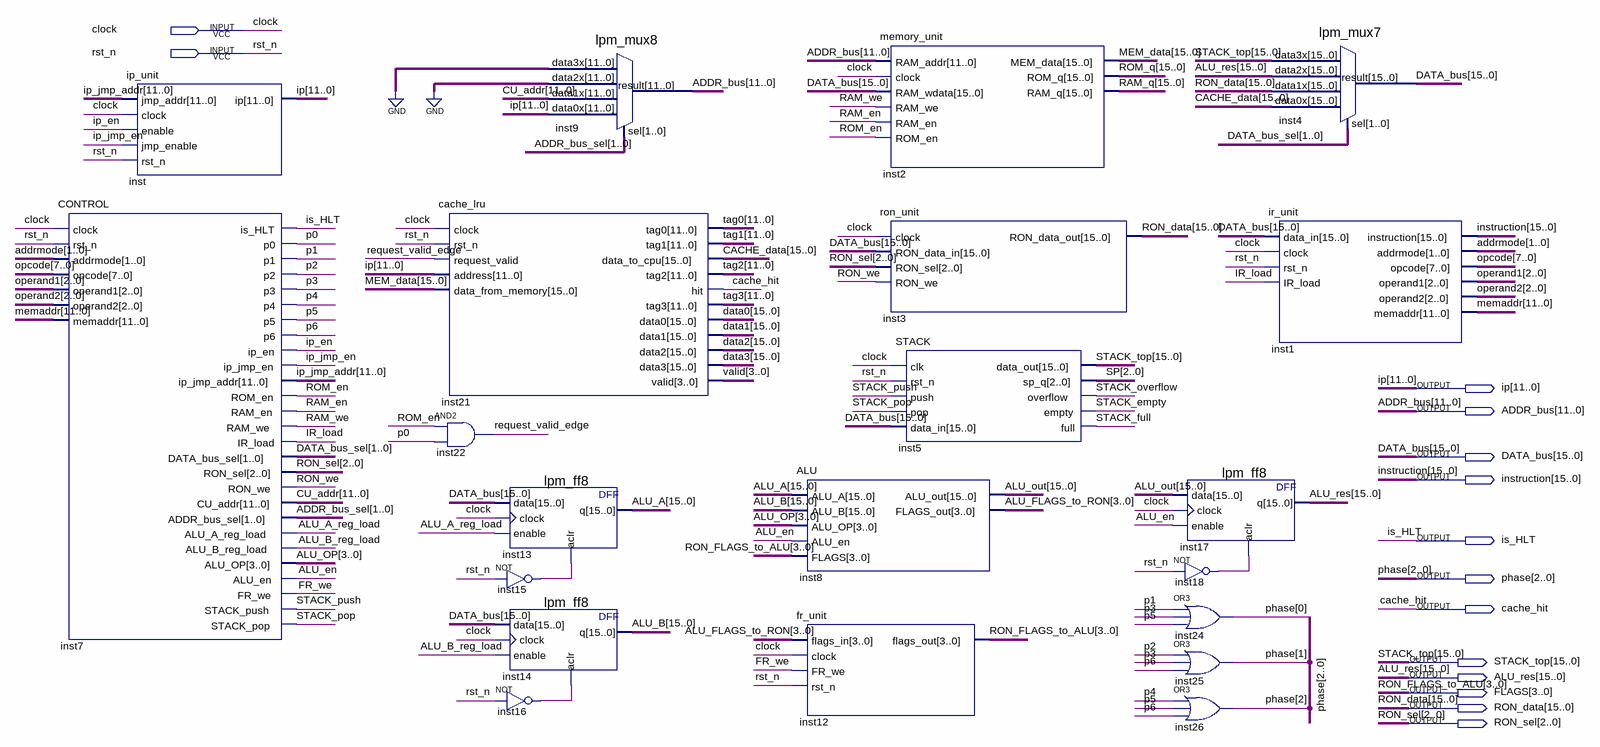
[diagram p0: schematic sheet]
// Quartus schematic top.bdf as structural Verilog: 21 symbols, 14 pins
module top (
  input  clock,
  input  rst_n,
  output [11:0] ip,
  output [11:0] ADDR_bus,
  output [15:0] DATA_bus,
  output [15:0] instruction,
  output is_HLT,
  output [2:0] phase,
  output cache_hit,
  output [15:0] STACK_top,
  output [15:0] ALU_res,
  output [3:0] FLAGS,
  output [15:0] RON_data,
  output [2:0] RON_sel
);

  wire ALU_A_reg_load, ALU_B_reg_load, ALU_en, FR_we, inst15_out, inst16_out, inst18_out, ip_en, ip_jmp_en,
       IR_load, p0, p1, p2, p3, p4, p5, p6, RAM_en, RAM_we, request_valid_edge, ROM_en, RON_we, STACK_empty,
       STACK_full, STACK_overflow, STACK_pop, STACK_push;
  wire [1:0] ADDR_bus_sel, addrmode, DATA_bus_sel;
  wire [2:0] operand1, operand2, SP;
  wire [3:0] ALU_FLAGS_to_RON, ALU_OP, valid;
  wire [7:0] opcode;
  wire [11:0] CU_addr, ip_jmp_addr, memaddr, tag0, tag1, tag2, tag3;
  wire [15:0] ALU_A, ALU_B, ALU_out, CACHE_data, data0, data1, data2, data3, MEM_data, RAM_q, ROM_q;

  CONTROL inst7 (
    .clock(clock), .rst_n(rst_n), .addrmode(addrmode), .opcode(opcode), .operand1(operand1),
    .operand2(operand2), .memaddr(memaddr), .is_HLT(is_HLT), .p0(p0), .p1(p1), .p2(p2), .p3(p3), .p4(p4),
    .p5(p5), .p6(p6), .ip_en(ip_en), .ip_jmp_en(ip_jmp_en), .ip_jmp_addr(ip_jmp_addr), .ROM_en(ROM_en),
    .RAM_en(RAM_en), .RAM_we(RAM_we), .IR_load(IR_load), .DATA_bus_sel(DATA_bus_sel), .RON_sel(RON_sel),
    .RON_we(RON_we), .CU_addr(CU_addr), .ADDR_bus_sel(ADDR_bus_sel), .ALU_A_reg_load(ALU_A_reg_load),
    .ALU_B_reg_load(ALU_B_reg_load), .ALU_OP(ALU_OP), .ALU_en(ALU_en), .FR_we(FR_we),
    .STACK_push(STACK_push), .STACK_pop(STACK_pop));
  ip_unit inst (.jmp_addr(ip_jmp_addr), .clock(clock), .enable(ip_en), .jmp_enable(ip_jmp_en), .rst_n(rst_n), .ip(ip));
  cache_lru inst21 (
    .clock(clock), .rst_n(rst_n), .request_valid(request_valid_edge), .address(ip),
    .data_from_memory(MEM_data), .tag0(tag0), .tag1(tag1), .data_to_cpu(CACHE_data), .tag2(tag2),
    .hit(cache_hit), .tag3(tag3), .data0(data0), .data1(data1), .data2(data2), .data3(data3), .valid(valid));
  and inst22 (request_valid_edge, ROM_en, p0);
  lpm_ff8 inst13 (.data(DATA_bus), .clock(clock), .enable(ALU_A_reg_load), .aclr(inst15_out), .q(ALU_A));
  not inst15 (inst15_out, rst_n);
  lpm_ff8 inst14 (.data(DATA_bus), .clock(clock), .enable(ALU_B_reg_load), .aclr(inst16_out), .q(ALU_B));
  not inst16 (inst16_out, rst_n);
  lpm_mux8 inst9 (
    .data3x({12{1'b0}}), .data2x({12{1'b0}}), .data1x(CU_addr), .data0x(ip), .sel(ADDR_bus_sel),
    .result(ADDR_bus));
  ALU inst8 (
    .ALU_A(ALU_A), .ALU_B(ALU_B), .ALU_OP(ALU_OP), .ALU_en(ALU_en), .FLAGS(FLAGS), .ALU_out(ALU_out),
    .FLAGS_out(ALU_FLAGS_to_RON));
  fr_unit inst12 (.flags_in(ALU_FLAGS_to_RON), .clock(clock), .FR_we(FR_we), .rst_n(rst_n), .flags_out(FLAGS));
  memory_unit inst2 (
    .RAM_addr(ADDR_bus), .clock(clock), .RAM_wdata(DATA_bus), .RAM_we(RAM_we), .RAM_en(RAM_en),
    .ROM_en(ROM_en), .MEM_data(MEM_data), .ROM_q(ROM_q), .RAM_q(RAM_q));
  ron_unit inst3 (.clock(clock), .RON_data_in(DATA_bus), .RON_sel(RON_sel), .RON_we(RON_we), .RON_data_out(RON_data));
  STACK inst5 (
    .clk(clock), .rst_n(rst_n), .push(STACK_push), .pop(STACK_pop), .data_in(DATA_bus), .data_out(STACK_top),
    .sp_q(SP), .overflow(STACK_overflow), .empty(STACK_empty), .full(STACK_full));
  lpm_ff8 inst17 (.data(ALU_out), .clock(clock), .enable(ALU_en), .aclr(inst18_out), .q(ALU_res));
  not inst18 (inst18_out, rst_n);
  or inst24 (phase[0], p1, p3, p5);
  or inst25 (phase[1], p2, p3, p6);
  or inst26 (phase[2], p4, p5, p6);
  lpm_mux7 inst4 (
    .data3x(STACK_top), .data2x(ALU_res), .data1x(RON_data), .data0x(CACHE_data), .sel(DATA_bus_sel),
    .result(DATA_bus));
  ir_unit inst1 (
    .data_in(DATA_bus), .clock(clock), .rst_n(rst_n), .IR_load(IR_load), .instruction(instruction),
    .addrmode(addrmode), .opcode(opcode), .operand1(operand1), .operand2(operand2), .memaddr(memaddr));

  // Other names for the same wires on the sheet: RON_FLAGS_to_ALU[3:0] = FLAGS
endmodule
